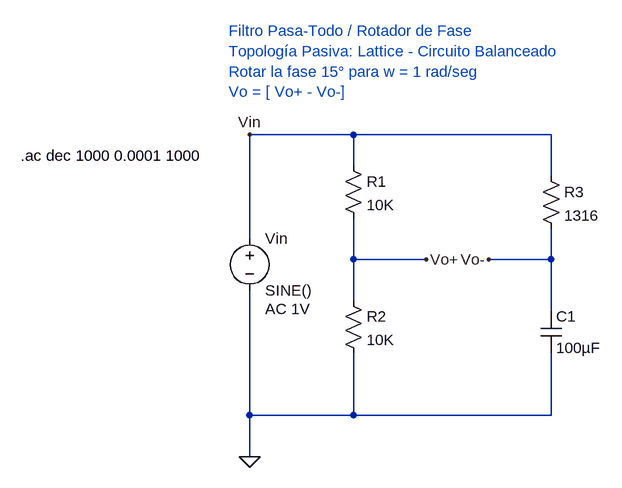
[diagram p0: schematic Filtro_PasaTodo_LatticePasivo.asc]
Filtro_PasaTodo_LatticePasivo.asc, the LTspice schematic file:
Version 4
SHEET 1 880 680
WIRE 192 80 32 80
WIRE 496 80 192 80
WIRE 192 128 192 80
WIRE 496 144 496 80
WIRE 32 240 32 80
WIRE 192 272 192 208
WIRE 304 272 192 272
WIRE 496 272 496 224
WIRE 496 272 400 272
WIRE 192 336 192 272
WIRE 496 352 496 272
WIRE 32 512 32 320
WIRE 192 512 192 416
WIRE 192 512 32 512
WIRE 496 512 496 416
WIRE 496 512 192 512
WIRE 32 576 32 512
FLAG 32 576 0
FLAG 32 80 Vin
FLAG 304 272 Vo+
FLAG 400 272 Vo-
SYMBOL res 176 112 R0
SYMATTR InstName R1
SYMATTR Value 10K
SYMBOL res 176 320 R0
SYMATTR InstName R2
SYMATTR Value 10K
SYMBOL cap 480 352 R0
SYMATTR InstName C1
SYMATTR Value 100µF
SYMBOL res 480 128 R0
SYMATTR InstName R3
SYMATTR Value 1316
SYMBOL voltage 32 224 R0
WINDOW 123 24 124 Left 2
WINDOW 39 0 0 Left 0
SYMATTR Value2 AC 1V
SYMATTR InstName Vin
SYMATTR Value SINE()
TEXT -320 112 Left 2 !.ac dec 1000 0.0001 1000
TEXT 0 -80 Left 2 ;Filtro Pasa-Todo / Rotador de Fase\nTopología Pasiva: Lattice - Circuito Balanceado\nRotar la fase 15° para w = 1 rad/seg\nVo = [ Vo+ - Vo-]

The netlist it stands for:
* Filtro_PasaTodo_LatticePasivo.asc
R1 Vin Vo+ 10K
R2 Vo+ 0 10K
C1 Vo- 0 100µF
R3 Vin Vo- 1316
Vin Vin 0 SINE() AC 1V
.ac dec 1000 0.0001 1000
* Filtro Pasa-Todo / Rotador de Fase
* Topología Pasiva: Lattice - Circuito Balanceado
* Rotar la fase 15° para w = 1 rad/seg
* Vo = [ Vo+ - Vo-]
.backanno
.end